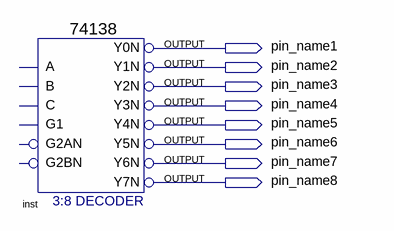
[diagram p0: schematic sheet]
// Quartus schematic test.bdf as structural Verilog: 1 symbols, 8 pins
module test (
  output pin_name1,
  output pin_name2,
  output pin_name3,
  output pin_name4,
  output pin_name5,
  output pin_name6,
  output pin_name7,
  output pin_name8
);

  \74138  inst (
    .Y0N(pin_name1), .Y1N(pin_name2), .Y2N(pin_name3), .Y3N(pin_name4), .Y4N(pin_name5), .Y5N(pin_name6),
    .Y6N(pin_name7), .Y7N(pin_name8));  // open: A, B, G1, C, G2AN, G2BN
endmodule
